# Altium schematic sheet Pedal System Circuit.SchDoc
size 225 x 129 mm; Origin: Eagle
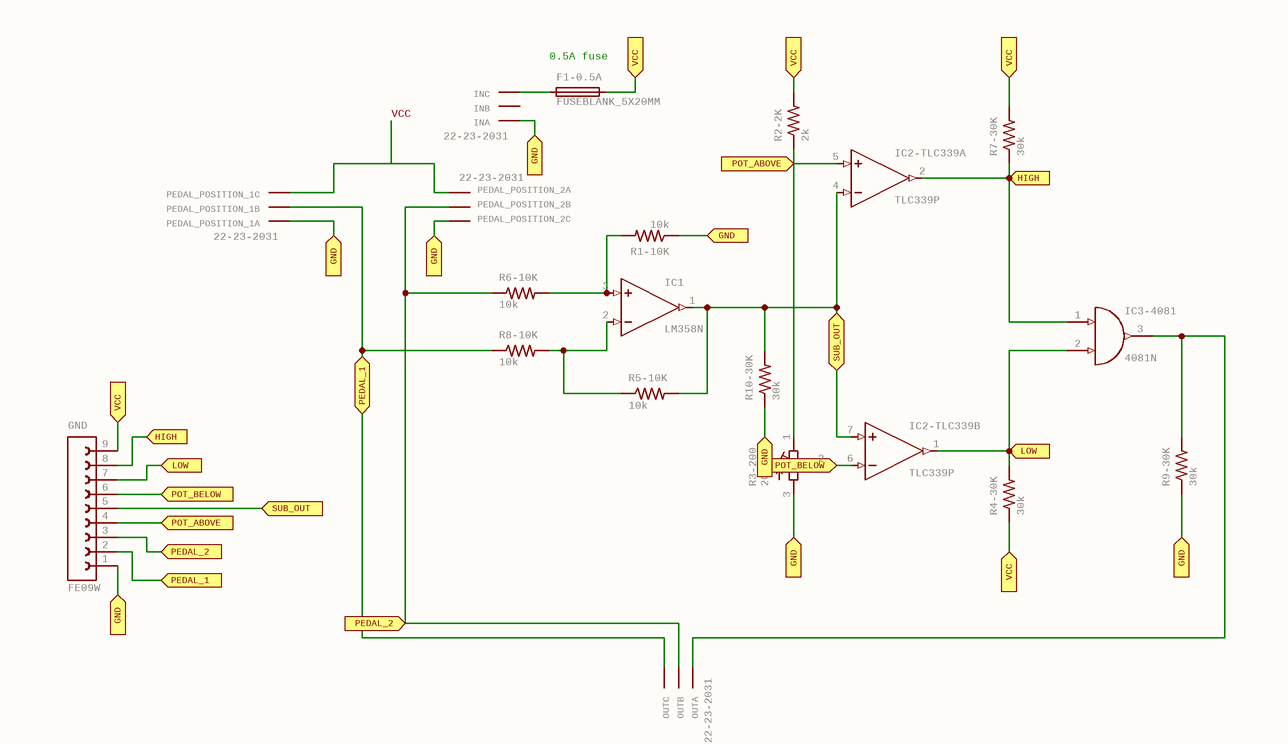
[diagram p0: Pedal System Circuit.SchDoc]

## Parts
F1-0.5A  FUSEBLANK_5X20MM  [FUSE_HOLDER_5X20MM]
GND  FE09W  [FE09W]
IC1  LM358N  [DIL08]
IC2-TLC339  TLC339P  [DIL14]  (parts A,B of 5)
IC3-4081  4081N  [DIL14]
IN  22-23-2031  [22-23-2031]  (parts A,B,C of 3)
OUT  22-23-2031  [22-23-2031]  (parts A,B,C of 3)
PEDAL_POSITION_1  22-23-2031  [22-23-2031]  (parts A,B,C of 3)
PEDAL_POSITION_2  22-23-2031  [22-23-2031]  (parts A,B,C of 3)
R1-10K  10k  [0207/12]
R2-2K  2k  [0309/12]
R3-200  200  [RTRIM43P]
R4-30K  30k  [0207/12]
R5-10K  10k  [0207/12]
R6-10K  10k  [0207/12]
R7-30K  30k  [0207/12]
R8-10K  10k  [0207/12]
R9-30K  30k  [0207/12]
R10-30K  30k  [0207/12]

## Ports
GND (in), HIGH (in), LOW (in), PEDAL_1 (in), PEDAL_2 (in), POT_ABOVE (in), POT_BELOW (in), SUB_OUT (in), VCC (in)

## Nets
GND: GND.1 IN.1(S) PEDAL_POSITION_1.1(S) PEDAL_POSITION_2.3(S) R1-10K.1 R3-200.3(A) R9-30K.1 R10-30K.1 ; port GND
HIGH: GND.8 IC2-TLC339.2(OUT) IC3-4081.1(I0) R7-30K.1 ; port HIGH
LOW: GND.7 IC2-TLC339.1(OUT) IC3-4081.2(I1) R4-30K.2 ; port LOW
PEDAL_1: GND.2 OUT.3(S) PEDAL_POSITION_1.2(S) R8-10K.1 ; port PEDAL_1
PEDAL_2: GND.3 OUT.2(S) PEDAL_POSITION_2.2(S) R6-10K.1 ; port PEDAL_2
POT_ABOVE: GND.4 IC2-TLC339.5(+IN) R2-2K.1 R3-200.1(E) ; port POT_ABOVE
POT_BELOW: GND.6 IC2-TLC339.6(-IN) R3-200.2(S) ; port POT_BELOW
SUB_OUT: GND.5 IC1.1(OUT) IC2-TLC339.4(-IN) IC2-TLC339.7(+IN) R5-10K.2 R10-30K.2 ; port SUB_OUT
VCC: F1-0.5A.2 GND.9 R2-2K.2 R4-30K.1 R7-30K.2 ; port VCC
VCC: PEDAL_POSITION_1.3(S) PEDAL_POSITION_2.1(S)  [a separate net that carries the same name]
NetF1-0.5A_1: F1-0.5A.1 IN.3(S)
NetIC1_2: IC1.2(-IN) R5-10K.1 R8-10K.2
NetIC1_3: IC1.3(+IN) R1-10K.2 R6-10K.2
NetIC3-4081_3: IC3-4081.3(O) OUT.1(S) R9-30K.2

Not connected (* = marked no-connect by the designer): IN 2(S)

## Notes on the sheet
- (near F1-0.5A) 0.5A fuse

## Library data of the parts
F1-0.5A = FUSEBLANK_5X20MM: Fuse; GateName_1: G$1; SymbolName_1: FUSE; DeviceName: BLANK_5X20MM; LibraryName: fuse; DeviceSetName: FUSE; MF: MF; MPN: MPN; OC_FARNELL: unknown; OC_NEWARK: unknown
GND = FE09W: FEMALE HEADER; GateName_1: G$1; SymbolName_1: FE09-1; LibraryName: con-lsta; DeviceSetName: FE09W; MF: MF; MPN: MPN; OC_FARNELL: unknown; OC_NEWARK: unknown
IC1 = LM358N: OP AMP also LM158; LM258; LM2904   Source: http://cache.national.com/ds/LM/LM158.pdf; GateName_1: A; SymbolName_1: OPAMP; DeviceName: N; DeviceSetName: LM358; LibraryName: linear
IC2-TLC339 = TLC339P: COMPARATOR; GateName_1: A; SymbolName_1: OPAMP; GateName_2: B; GateName_3: C; GateName_4: D; GateName_5: P; SymbolName_5: PWR+-; DeviceSetName: TLC339; SymbolName_2: OPAMP; SymbolName_3: OPAMP; SymbolName_4: OPAMP; DeviceName: P; LibraryName: linear
IC3-4081 = 4081N: Quad 2-input AND; GateName_1: A; SymbolName_1: 4081; DeviceName: N; LibraryName: 40xx; DeviceSetName: 4081
IN OUT PEDAL_POSITION_1 PEDAL_POSITION_2 = 22-23-2031: .100" (2.54mm) Center Header - 3 Pin; GateName_1: -1; SymbolName_1: MV; GateName_2: -2; SymbolName_2: M; GateName_3: -3; MF: MOLEX; SymbolName_3: M; LibraryName: con-molex; DeviceSetName: 22-23-2031; MPN: 22-23-2031; OC_FARNELL: 1462950; OC_NEWARK: 30C0862
R1-10K R4-30K R5-10K R6-10K R7-30K R8-10K R9-30K R10-30K = R-US_0207/12: RESISTOR, American symbol; GateName_1: G$1; SymbolName_1: R-US; DeviceSetName: R-US_; DeviceName: 0207/12; LibraryName: resistor
R2-2K = R-US_0309/12: RESISTOR, American symbol; GateName_1: G$1; SymbolName_1: R-US; DeviceSetName: R-US_; DeviceName: 0309/12; LibraryName: resistor
R3-200 = R-TRIMM43P: Trimm resistor; GateName_1: G$1; SymbolName_1: R-TRIM-1; DeviceName: 43P; LibraryName: resistor; DeviceSetName: R-TRIMM